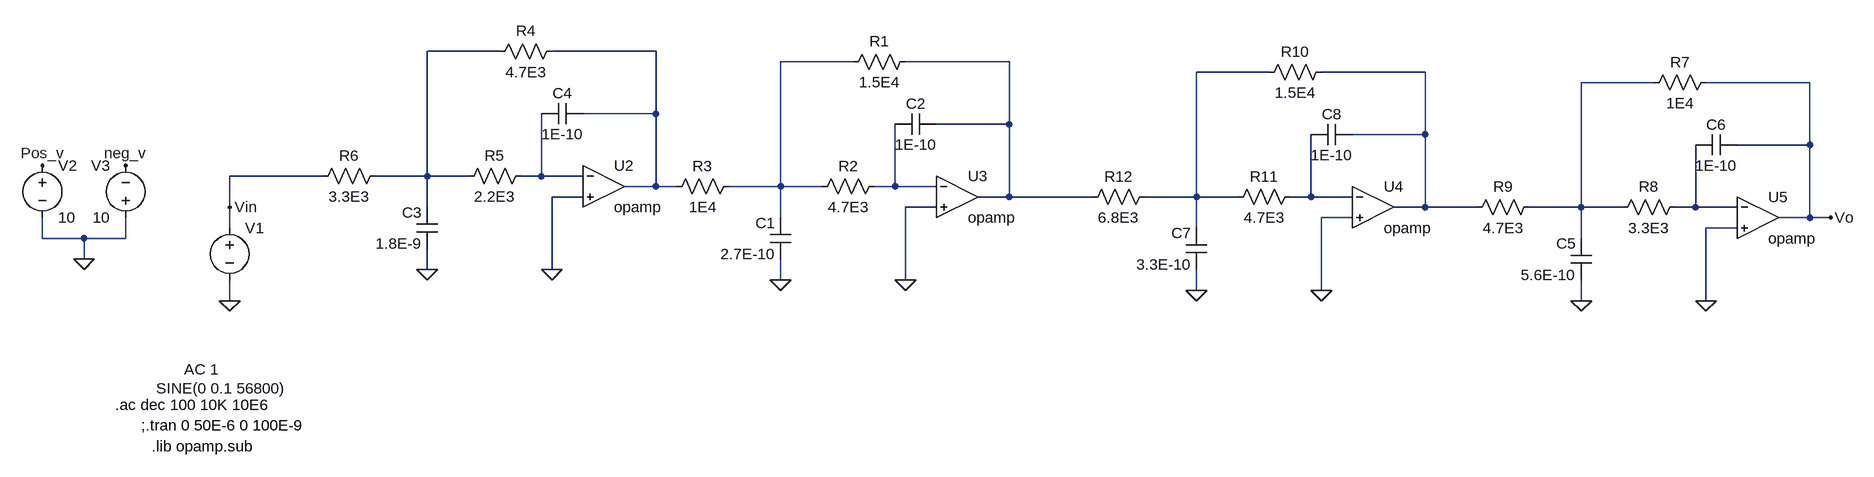
[diagram p0: schematic High order E12.asc]
High order E12.asc, the LTspice schematic file:
Version 4
SHEET 1 2176 680
WIRE 80 -160 -32 -160
WIRE 320 -160 160 -160
WIRE 624 -144 512 -144
WIRE 864 -144 704 -144
WIRE 1264 -128 1152 -128
WIRE 1504 -128 1344 -128
WIRE 1856 -112 1744 -112
WIRE 2096 -112 1936 -112
WIRE 320 -64 320 -160
WIRE 320 -64 208 -64
WIRE 864 -48 864 -144
WIRE 864 -48 752 -48
WIRE 1504 -32 1504 -128
WIRE 1504 -32 1392 -32
WIRE 2096 -16 2096 -112
WIRE 2096 -16 1984 -16
WIRE -192 32 -336 32
WIRE -32 32 -32 -160
WIRE -32 32 -112 32
WIRE 32 32 -32 32
WIRE 144 32 144 -64
WIRE 144 32 112 32
WIRE 208 32 144 32
WIRE 320 48 320 -64
WIRE 320 48 272 48
WIRE 352 48 320 48
WIRE 512 48 512 -144
WIRE 512 48 432 48
WIRE 576 48 512 48
WIRE 688 48 688 -48
WIRE 688 48 656 48
WIRE 752 48 688 48
WIRE 208 64 160 64
WIRE 864 64 864 -48
WIRE 864 64 816 64
WIRE 992 64 864 64
WIRE 1152 64 1152 -128
WIRE 1152 64 1072 64
WIRE 1216 64 1152 64
WIRE 1328 64 1328 -32
WIRE 1328 64 1296 64
WIRE 1392 64 1328 64
WIRE -336 80 -336 32
WIRE -32 80 -32 32
WIRE 752 80 704 80
WIRE 1504 80 1504 -32
WIRE 1504 80 1456 80
WIRE 1584 80 1504 80
WIRE 1744 80 1744 -112
WIRE 1744 80 1664 80
WIRE 1808 80 1744 80
WIRE 1920 80 1920 -16
WIRE 1920 80 1888 80
WIRE 1984 80 1920 80
WIRE 512 96 512 48
WIRE 1392 96 1344 96
WIRE 2096 96 2096 -16
WIRE 2096 96 2048 96
WIRE 2128 96 2096 96
WIRE -336 112 -336 80
WIRE 1152 112 1152 64
WIRE 1984 112 1936 112
WIRE -624 128 -624 96
WIRE -560 128 -624 128
WIRE -496 128 -496 96
WIRE -496 128 -560 128
WIRE 1744 128 1744 80
WIRE -560 160 -560 128
WIRE -32 176 -32 144
WIRE 160 176 160 64
WIRE 512 192 512 160
WIRE 704 192 704 80
WIRE 1152 208 1152 176
WIRE 1344 208 1344 96
WIRE -336 224 -336 192
WIRE 1744 224 1744 192
WIRE 1936 224 1936 112
FLAG 704 192 0
FLAG 512 192 0
FLAG -336 224 0
FLAG -624 16 Pos_v
FLAG -496 16 neg_v
FLAG -560 160 0
FLAG 2128 96 Vo
FLAG -336 80 Vin
FLAG 160 176 0
FLAG -32 176 0
FLAG 1936 224 0
FLAG 1744 224 0
FLAG 1344 208 0
FLAG 1152 208 0
SYMBOL res 720 -160 R90
WINDOW 0 0 56 VBottom 2
WINDOW 3 32 56 VTop 2
SYMATTR InstName R1
SYMATTR Value 1.5E4
SYMBOL res 672 32 R90
WINDOW 0 0 56 VBottom 2
WINDOW 3 32 56 VTop 2
SYMATTR InstName R2
SYMATTR Value 4.7E3
SYMBOL res 448 32 R90
WINDOW 0 0 56 VBottom 2
WINDOW 3 32 56 VTop 2
SYMATTR InstName R3
SYMATTR Value 1E4
SYMBOL cap 528 160 R180
WINDOW 0 24 56 Left 2
WINDOW 3 24 8 Left 2
SYMATTR InstName C1
SYMATTR Value 2.7E-10
SYMBOL cap 688 -32 R270
WINDOW 0 32 32 VTop 2
WINDOW 3 0 32 VBottom 2
SYMATTR InstName C2
SYMATTR Value 1E-10
SYMBOL voltage -336 96 R0
WINDOW 123 -70 234 Left 2
WINDOW 39 0 0 Left 0
WINDOW 3 -113 263 Left 2
SYMATTR Value2 AC 1
SYMATTR Value SINE(0 0.1 56800)
SYMATTR InstName V1
SYMBOL voltage -624 0 R0
SYMATTR InstName V2
SYMATTR Value 10
SYMBOL voltage -496 112 R180
WINDOW 0 24 96 Left 2
WINDOW 3 24 16 Left 2
SYMATTR InstName V3
SYMATTR Value 10
SYMBOL res 176 -176 R90
WINDOW 0 0 56 VBottom 2
WINDOW 3 32 56 VTop 2
SYMATTR InstName R4
SYMATTR Value 4.7E3
SYMBOL res 128 16 R90
WINDOW 0 0 56 VBottom 2
WINDOW 3 32 56 VTop 2
SYMATTR InstName R5
SYMATTR Value 2.2E3
SYMBOL res -96 16 R90
WINDOW 0 0 56 VBottom 2
WINDOW 3 32 56 VTop 2
SYMATTR InstName R6
SYMATTR Value 3.3E3
SYMBOL cap -16 144 R180
WINDOW 0 24 56 Left 2
WINDOW 3 24 8 Left 2
SYMATTR InstName C3
SYMATTR Value 1.8E-9
SYMBOL cap 144 -48 R270
WINDOW 0 32 32 VTop 2
WINDOW 3 0 32 VBottom 2
SYMATTR InstName C4
SYMATTR Value 1E-10
SYMBOL res 1952 -128 R90
WINDOW 0 0 56 VBottom 2
WINDOW 3 32 56 VTop 2
SYMATTR InstName R7
SYMATTR Value 1E4
SYMBOL res 1904 64 R90
WINDOW 0 0 56 VBottom 2
WINDOW 3 32 56 VTop 2
SYMATTR InstName R8
SYMATTR Value 3.3E3
SYMBOL res 1680 64 R90
WINDOW 0 0 56 VBottom 2
WINDOW 3 32 56 VTop 2
SYMATTR InstName R9
SYMATTR Value 4.7E3
SYMBOL cap 1760 192 R180
WINDOW 0 24 56 Left 2
WINDOW 3 24 8 Left 2
SYMATTR InstName C5
SYMATTR Value 5.6E-10
SYMBOL cap 1920 0 R270
WINDOW 0 32 32 VTop 2
WINDOW 3 0 32 VBottom 2
SYMATTR InstName C6
SYMATTR Value 1E-10
SYMBOL res 1360 -144 R90
WINDOW 0 0 56 VBottom 2
WINDOW 3 32 56 VTop 2
SYMATTR InstName R10
SYMATTR Value 1.5E4
SYMBOL res 1312 48 R90
WINDOW 0 0 56 VBottom 2
WINDOW 3 32 56 VTop 2
SYMATTR InstName R11
SYMATTR Value 4.7E3
SYMBOL res 1088 48 R90
WINDOW 0 0 56 VBottom 2
WINDOW 3 32 56 VTop 2
SYMATTR InstName R12
SYMATTR Value 6.8E3
SYMBOL cap 1168 176 R180
WINDOW 0 24 56 Left 2
WINDOW 3 24 8 Left 2
SYMATTR InstName C7
SYMATTR Value 3.3E-10
SYMBOL cap 1328 -16 R270
WINDOW 0 32 32 VTop 2
WINDOW 3 0 32 VBottom 2
SYMATTR InstName C8
SYMATTR Value 1E-10
SYMBOL Opamps\\opamp 240 -16 R0
SYMATTR InstName U2
SYMBOL Opamps\\opamp 784 0 R0
SYMATTR InstName U3
SYMBOL Opamps\\opamp 1424 16 R0
SYMATTR InstName U4
SYMBOL Opamps\\opamp 2016 32 R0
SYMATTR InstName U5
TEXT -512 384 Left 2 !.ac dec 100 10K 10E6
TEXT -472 416 Left 2 !;.tran 0 50E-6 0 100E-9
TEXT -456 448 Left 2 !.lib opamp.sub

The netlist it stands for:
* High order E12.asc
R1 N004 N003 1.5E4
R2 N009 N003 4.7E3
R3 N003 N002 1E4
C1 0 N003 2.7E-10
C2 N009 N004 1E-10
V1 Vin 0 SINE(0 0.1 56800) AC 1
V2 Pos_v 0 10
V3 0 neg_v 10
R4 N002 N001 4.7E3
R5 N008 N001 2.2E3
R6 N001 Vin 3.3E3
C3 0 N001 1.8E-9
C4 N008 N002 1E-10
R7 Vo N007 1E4
R8 N011 N007 3.3E3
R9 N007 N006 4.7E3
C5 0 N007 5.6E-10
C6 N011 Vo 1E-10
R10 N006 N005 1.5E4
R11 N010 N005 4.7E3
R12 N005 N004 6.8E3
C7 0 N005 3.3E-10
C8 N010 N006 1E-10
XU2 N008 0 N002 opamp Aol=100K GBW=10Meg  ; pins invin noninvin out
XU3 N009 0 N004 opamp Aol=100K GBW=10Meg  ; pins invin noninvin out
XU4 N010 0 N006 opamp Aol=100K GBW=10Meg  ; pins invin noninvin out
XU5 N011 0 Vo opamp Aol=100K GBW=10Meg  ; pins invin noninvin out
.ac dec 100 10K 10E6
;.tran 0 50E-6 0 100E-9
.lib opamp.sub
.backanno
.end

* Results of the author's LTspice run, read from the files saved beside the schematic
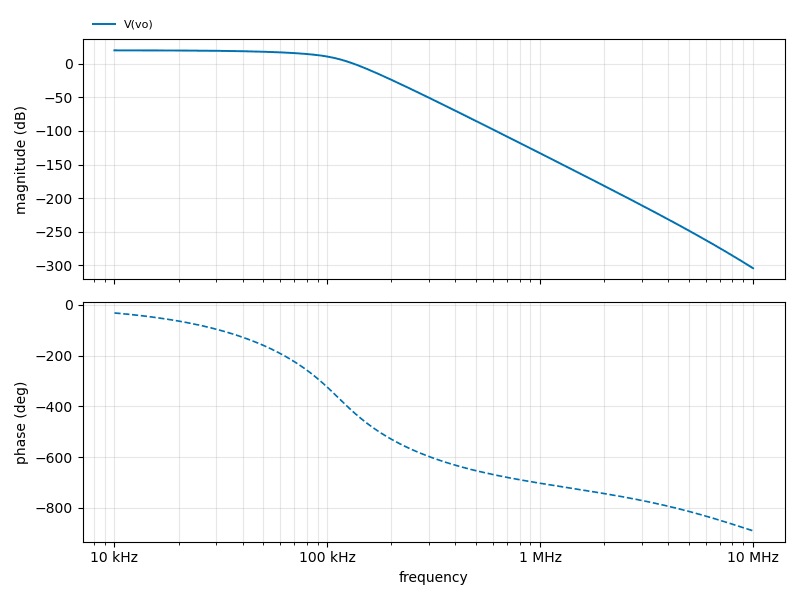
[diagram p1: AC Analysis of High order E12.asc, plotted from the saved traces]
* AC Analysis, 1 run:
*   V(vo): 19.93 dB at 10 kHz, -304.21 dB at 10 MHz, peak 19.93 dB at 10 kHz, 3 dB below the peak at 60.04 kHz